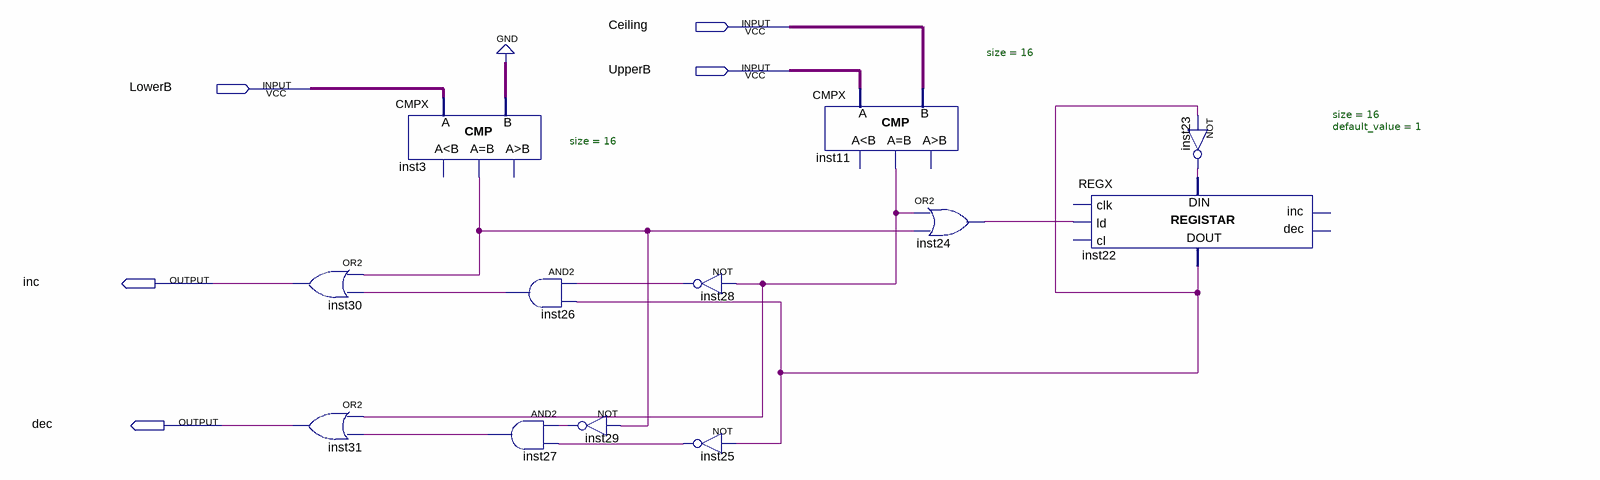
[diagram p0: schematic sheet]
// Quartus schematic Quote Ilic --Ona budza--.bdf as structural Verilog: 12 symbols, 5 pins
module \Quote_Ilic_--Ona_budza--  (
  input  Ceiling,
  input  UpperB,
  input  LowerB,
  output inc,
  output dec
);

  wire inst3_eq, inst11_eq, inst22_data_out, inst23_out, inst24_out, inst25_out, inst26_out, inst27_out,
       inst28_out, inst29_out;
  wire [15:0] undriven, undriven_2, undriven_3;

  or inst30 (inc, inst3_eq, inst26_out);
  or inst31 (dec, inst11_eq, inst27_out);
  CMPX #(.size(16)) inst3 (.A(undriven), .B({16{1'b0}}), .eq(inst3_eq));  // open: ls, gr
  and inst26 (inst26_out, inst28_out, inst22_data_out);
  and inst27 (inst27_out, inst29_out, inst25_out);
  not inst29 (inst29_out, inst3_eq);
  not inst28 (inst28_out, inst11_eq);
  not inst25 (inst25_out, inst22_data_out);
  CMPX #(.size(16)) inst11 (.A(undriven_2), .B(undriven_3), .eq(inst11_eq));  // open: ls, gr
  or inst24 (inst24_out, inst11_eq, inst3_eq);
  REGX #(.size(16), .default_value(1)) inst22 (
    .ld(inst24_out), .data_in({16{inst23_out}}), .data_out(inst22_data_out));  // open: clk, cl, inc, dec
  not inst23 (inst23_out, inst22_data_out);
endmodule
